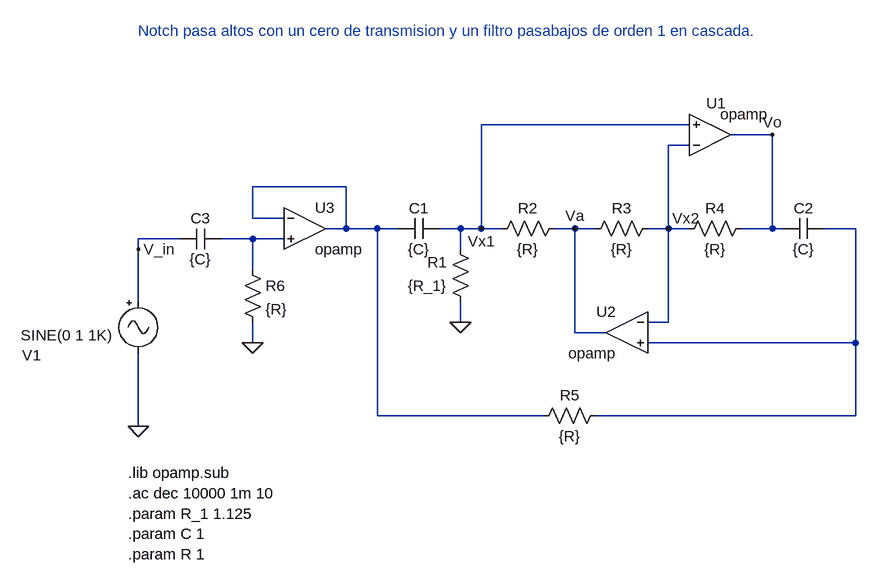
[diagram p0: schematic ts6_hp.asc]
ts6_hp.asc, the LTspice schematic file:
Version 4
SHEET 1 1780 1008
WIRE 1248 128 928 128
WIRE 1376 144 1312 144
WIRE 1248 160 1216 160
WIRE 720 224 576 224
WIRE 576 272 576 224
WIRE 624 272 576 272
WIRE 720 288 720 224
WIRE 720 288 688 288
WIRE 768 288 720 288
WIRE 800 288 768 288
WIRE 896 288 864 288
WIRE 928 288 928 128
WIRE 928 288 896 288
WIRE 960 288 928 288
WIRE 1072 288 1040 288
WIRE 1104 288 1072 288
WIRE 1216 288 1216 160
WIRE 1216 288 1184 288
WIRE 1248 288 1216 288
WIRE 1376 288 1376 144
WIRE 1376 288 1328 288
WIRE 1392 288 1376 288
WIRE 1504 288 1456 288
WIRE 464 304 400 304
WIRE 576 304 528 304
WIRE 624 304 576 304
WIRE 400 320 400 304
WIRE 896 320 896 288
WIRE 576 352 576 304
WIRE 400 400 400 320
WIRE 896 432 896 400
WIRE 1216 432 1216 288
WIRE 1216 432 1184 432
WIRE 1072 448 1072 288
WIRE 1120 448 1072 448
WIRE 576 464 576 432
WIRE 1504 464 1504 288
WIRE 1504 464 1184 464
WIRE 768 576 768 288
WIRE 1024 576 768 576
WIRE 1504 576 1504 464
WIRE 1504 576 1104 576
WIRE 400 592 400 480
FLAG 400 592 0
FLAG 400 320 V_in
FLAG 896 432 0
FLAG 1376 144 Vo
FLAG 928 288 Vx1
FLAG 1072 288 Va
FLAG 1216 288 Vx2
FLAG 576 464 0
SYMBOL Misc/signal 400 384 R0
WINDOW 0 -179 99 Left 2
WINDOW 3 -181 68 Left 2
SYMATTR InstName V1
SYMATTR Value2 AC 1
SYMBOL Opamps/opamp 1280 208 M180
WINDOW 0 -6 113 Left 2
SYMATTR InstName U1
SYMBOL res 912 416 R180
WINDOW 0 36 76 Left 2
WINDOW 3 36 40 Left 2
SYMATTR InstName R1
SYMATTR Value {R_1}
SYMBOL res 1056 272 R90
WINDOW 0 0 56 VBottom 2
WINDOW 3 32 56 VTop 2
SYMATTR InstName R2
SYMATTR Value {R}
SYMBOL res 1200 272 R90
WINDOW 0 0 56 VBottom 2
WINDOW 3 32 56 VTop 2
SYMATTR InstName R3
SYMATTR Value {R}
SYMBOL res 1344 272 R90
WINDOW 0 0 56 VBottom 2
WINDOW 3 32 56 VTop 2
SYMATTR InstName R4
SYMATTR Value {R}
SYMBOL cap 864 272 R90
WINDOW 0 0 32 VBottom 2
WINDOW 3 32 32 VTop 2
SYMATTR InstName C1
SYMATTR Value {C}
SYMBOL cap 1456 272 R90
WINDOW 0 0 32 VBottom 2
WINDOW 3 32 32 VTop 2
SYMATTR InstName C2
SYMATTR Value {C}
SYMBOL Opamps/opamp 1152 384 M0
SYMATTR InstName U2
SYMBOL res 1120 560 R90
WINDOW 0 0 56 VBottom 2
WINDOW 3 32 56 VTop 2
SYMATTR InstName R5
SYMATTR Value {R}
SYMBOL res 560 336 R0
SYMATTR InstName R6
SYMATTR Value {R}
SYMBOL cap 528 288 R90
WINDOW 0 0 32 VBottom 2
WINDOW 3 32 32 VTop 2
SYMATTR InstName C3
SYMATTR Value {C}
SYMBOL Opamps/opamp 656 224 R0
SYMATTR InstName U3
TEXT 384 664 Left 2 !.lib opamp.sub\n.ac dec 10000 1m 10\n.param R_1 1.125\n.param C 1\n.param R 1
TEXT 400 -16 Left 2 ;Notch pasa altos con un cero de transmision y un filtro pasabajos de orden 1 en cascada.

The netlist it stands for:
* ts6_hp.asc
V1 V_in 0 SINE(0 1 1K) AC 1
XU1 Vx2 Vx1 Vo opamp Aol=100K GBW=10Meg  ; pins invin noninvin out
R1 0 Vx1 {R_1}
R2 Va Vx1 {R}
R3 Vx2 Va {R}
R4 Vo Vx2 {R}
C1 Vx1 N001 {C}
C2 N002 Vo {C}
XU2 Vx2 N002 Va opamp Aol=100K GBW=10Meg  ; pins invin noninvin out
R5 N002 N001 {R}
R6 N003 0 {R}
C3 N003 V_in {C}
XU3 N001 N003 N001 opamp Aol=100K GBW=10Meg  ; pins invin noninvin out
.lib opamp.sub
.ac dec 10000 1m 10
.param R_1 1.125
.param C 1
.param R 1
* Notch pasa altos con un cero de transmision y un filtro pasabajos de orden 1 en cascada.
.backanno
.end